# Altium schematic sheet Sheet2.SchDoc
size A4; SheetNumber: 2; SheetTotal: 2
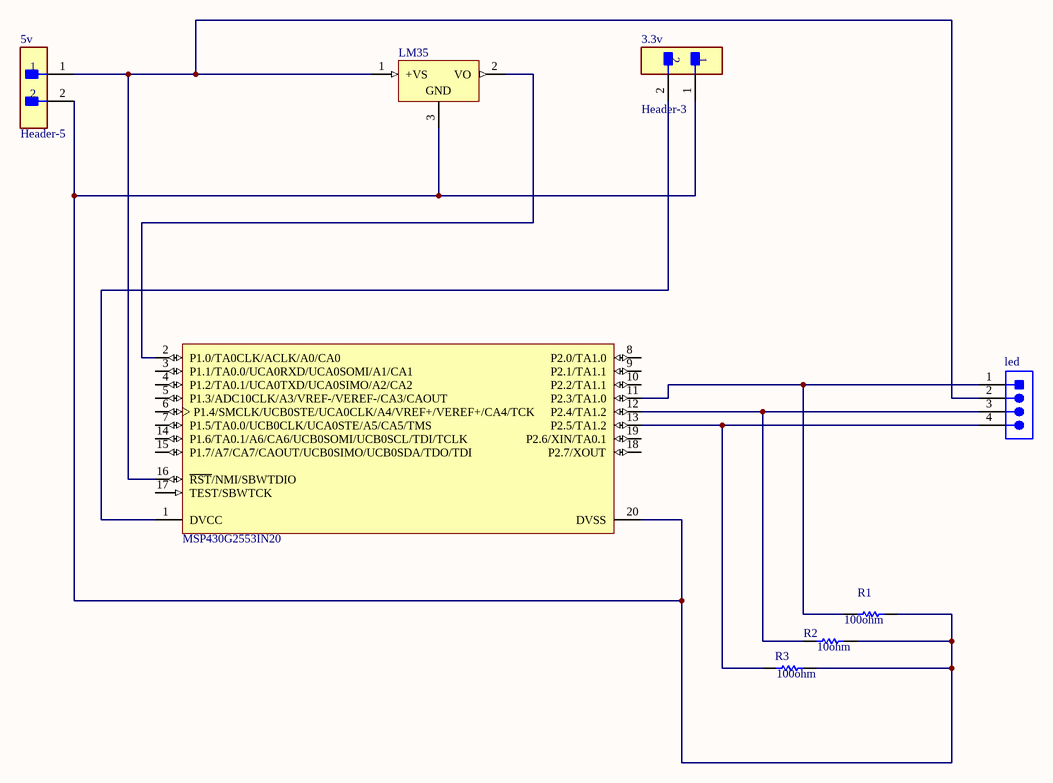
[diagram p0: Sheet2.SchDoc]

## Parts
3.3v  Header-3  [FP-TSW-102-07-L-S-MFG]
5v  Header-5  [FP-TSW-102-07-L-S-MFG]
?  MSP430G2553IN20  [N0020A]
led  (no value)  [JST-S4B-XH-A(LF)(SN)_V]
LM35  (no value)  [LP0003A]
R1  value 100ohm  [AXIAL-0.3]
R2  value 10ohm  [AXIAL-0.3]
R3  value 100ohm  [AXIAL-0.3]

## Nets
Net3.3v_1: 3.3v.1 5v.2 ?.20(DVSS) LM35.3(GND) R1.2 R2.2 R3.2
Net3.3v_2: 3.3v.2 ?.1(DVCC)
Net5v_1: 5v.1 ?.16(~{RST}/NMI/SBWTDIO) led.2 LM35.1(+VS)
Net?_2: ?.2(P1.0/TA0CLK/ACLK/A0/CA0) LM35.2(VO)
Net?_11: ?.11(P2.3/TA1.0) led.1 R1.1
Net?_12: ?.12(P2.4/TA1.2) led.3 R2.1
Net?_13: ?.13(P2.5/TA1.2) led.4 R3.1

Not connected (* = marked no-connect by the designer): ? 3(P1.1/TA0.0/UCA0RXD/UCA0SOMI/A1/CA1) 4(P1.2/TA0.1/UCA0TXD/UCA0SIMO/A2/CA2) 5(P1.3/ADC10CLK/A3/VREF-/VEREF-/CA3/CAOUT) 6(P1.4/SMCLK/UCB0STE/UCA0CLK/A4/VREF+/VEREF+/CA4/TCK) 7(P1.5/TA0.0/UCB0CLK/UCA0STE/A5/CA5/TMS) 8(P2.0/TA1.0) 9(P2.1/TA1.1) 10(P2.2/TA1.1) 14(P1.6/TA0.1/A6/CA6/UCB0SOMI/UCB0SCL/TDI/TCLK) 15(P1.7/A7/CA7/CAOUT/UCB0SIMO/UCB0SDA/TDO/TDI) 17(TEST/SBWTCK) 18(P2.7/XOUT) 19(P2.6/XIN/TA0.1)

## Library data of the parts
3.3v 5v = CMP-02766-001428-1: CONN HEADER VERT 2POS 2.54MM; Voltage Rating: 550V; Current Rating: 7.6A; Gender: Male; Number of Contacts: 2; Connector Type: Male Pin; Radiation Hardening: No; Orientation: Straight; Contact Plating: Gold; Max Operating Temperature: 125°C; Mount: Through Hole; Package Quantity: 1; Number of Rows: 1; Housing Material: Polyester; RoHS Compliant: Yes; Length: 5.08mm; Max Voltage Rating (AC): 550V; Pitch: 2.54mm; Packaging: Bulk; Depth: 2.54mm; Termination: Solder; Min Operating Temperature: -55°C; Housing Color: Black; Lead Free: Lead Free; Color: Black; Number of Positions: 2; Width: 2.54mm; Max Current Rating: 7.6A; REACH SVHC: No SVHC; Contact Material: Bronze; Contact Mating Length: 0.23inch; Series: TSW; Contact Type: Male Pin
? = CMP-0365-00184-2: 16 MHz Mixed Signal Microcontroller with 16 KB Flash, 512 B SRAM and 24 GPIOs, -40 to 85 degC, 20-pin DIP (N), Pb-Free (RoHS); Manufacturer: Texas Instruments; USCI_B (I2C & SPI): 1; Temp Sensor: Yes; SubFamily: Value Line; Frequency(MHz): 16; ADC Channels: 8; SRAM(B): 512; ADC: 10-bit SAR; GPIO: 24; Timers - 16-bit: 2; Code_JEDEC: MS-001; Eco-Plan: Pb-Free (RoHS); PartNumber: MSP430G2553IN20; ComponentLink1URL: http://www.ti.com/; PackageVersion: 4040049/E; Comparators: Yes; Watchdog: Yes; ComponentLink2Description: Datasheet; ComponentLink1Description: Manufacturer URL; Mounting Technology: Through Hole; ComponentLink2URL: http://www.ti.com/general/docs/lit/getliterature.tsp?genericPartNumber=MSP430G2553&fileType=pdf; Brown Out Reset: Yes; PackageReference: N0020A; PackageDescription: 20-Pin Plastic In-Line, Body 25.40 x 6.35 mm, Pitch 2.54 mm; ComponentLink3URL: http://www.ti.com/litv/pdf/mpds177g; ComponentLink3Description: Package Specification; Flash(KB): 16; Cap touch I/O: Yes; USCI_A (UART/LIN/IrDA/SPI): 1; DatasheetVersion: SLAS735G
led = CMP-1755-00007-1: Male Header, Pitch 2.5 mm, 1 x 4 Position, Height 6.1 mm, Tail Length 3.4 mm, -25 to 85 degC, RoHS, Bulk; PackageReference: S4B-XH-A(LF)(SN); ComponentLink1Description: Manufacturer URL; DatasheetVersion: May-16; ComponentLink2Description: Datasheet; ComponentLink2URL: http://www.jst-mfg.com/product/pdf/eng/eXH.pdf; ComponentLink1URL: http://www.jst.com/home2.html; PackageDescription: Male Header, Pitch 2.5 mm, 1 x 4 Position, Height 6.1 mm, Tail Length 3.4 mm
LM35 = CMP-0066-00030-3: Precision Centigrade Temperature Sensor, 3-pin TO-92, Pb-Free; Manufacturer: Texas Instruments; PowerWise: N; PackageTopMarking: NSXYTT*LM35*DZ; CompType: Temp Sensor IC; RoHS: Y; PackageReference: LP0003A; PinCount: 3; ComponentLink1URL: http://www.ti.com/general/docs/lit/getliterature.tsp?genericPartNumber=LM35&fileType=pdf; Code_JEDEC: TO-226-AA; PackageDescription: TO-92, Molded, 3 Lead; ComponentLink1Description: Datasheet URL
R1-R3 = Res1: Resistor; Published: 8-Jun-2000; LatestRevisionDate: 17-Jul-2002; LatestRevisionNote: Re-released for DXP Platform.; PackageReference: AXIAL-0.3; Publisher: Altium Limited; PackageDescription: Axial Device, Thru-Hole; 2 Leads; 0.3 in Pin Spacing